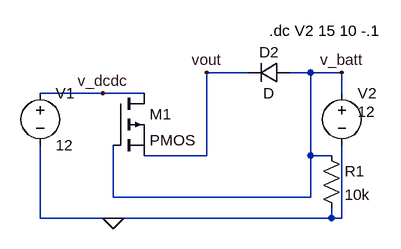
[diagram p0: schematic MHR15-GLV_PWR.asc]
MHR15-GLV_PWR.asc, the LTspice schematic file:
Version 4
SHEET 1 880 680
WIRE 352 96 288 96
WIRE 448 96 416 96
WIRE 496 96 448 96
WIRE 128 128 32 128
WIRE 192 128 128 128
WIRE 496 128 496 96
WIRE 288 224 288 96
WIRE 288 224 192 224
WIRE 448 224 448 96
WIRE 480 224 448 224
WIRE 144 288 144 208
WIRE 448 288 448 224
WIRE 448 288 144 288
WIRE 32 320 32 208
WIRE 144 320 32 320
WIRE 480 320 480 304
WIRE 480 320 144 320
WIRE 496 320 496 208
WIRE 496 320 480 320
FLAG 144 320 0
FLAG 288 96 vout
FLAG 128 128 v_dcdc
FLAG 496 96 v_batt
SYMBOL voltage 32 112 R0
WINDOW 123 0 0 Left 2
WINDOW 39 0 0 Left 2
SYMATTR InstName V1
SYMATTR Value 12
SYMBOL voltage 496 112 R0
WINDOW 3 24 44 Left 2
WINDOW 123 0 0 Left 2
WINDOW 39 0 0 Left 2
SYMATTR InstName V2
SYMATTR Value 12
SYMBOL diode 416 80 R90
WINDOW 0 0 32 VBottom 2
WINDOW 3 32 32 VTop 2
SYMATTR InstName D2
SYMBOL pmos 144 128 R0
SYMATTR InstName M1
SYMBOL res 464 208 R0
SYMATTR InstName R1
SYMATTR Value 10k
TEXT 384 32 Left 2 !.dc V2 15 10 -.1

The netlist it stands for:
* MHR15-GLV_PWR.asc
V1 v_dcdc 0 12
V2 v_batt 0 12
D2 v_batt vout D
M1 v_dcdc v_batt vout vout PMOS
R1 v_batt 0 10k
.model D D
.lib standard.dio
.model NMOS NMOS
.model PMOS PMOS
.lib standard.mos
.dc V2 15 10 -.1
.backanno
.end